# EAGLE design EEZ DIB BP3C r3B1 (EAGLE 7.2.0)
Assembly variants: Farnell, TME

## Sheet 1 of 2
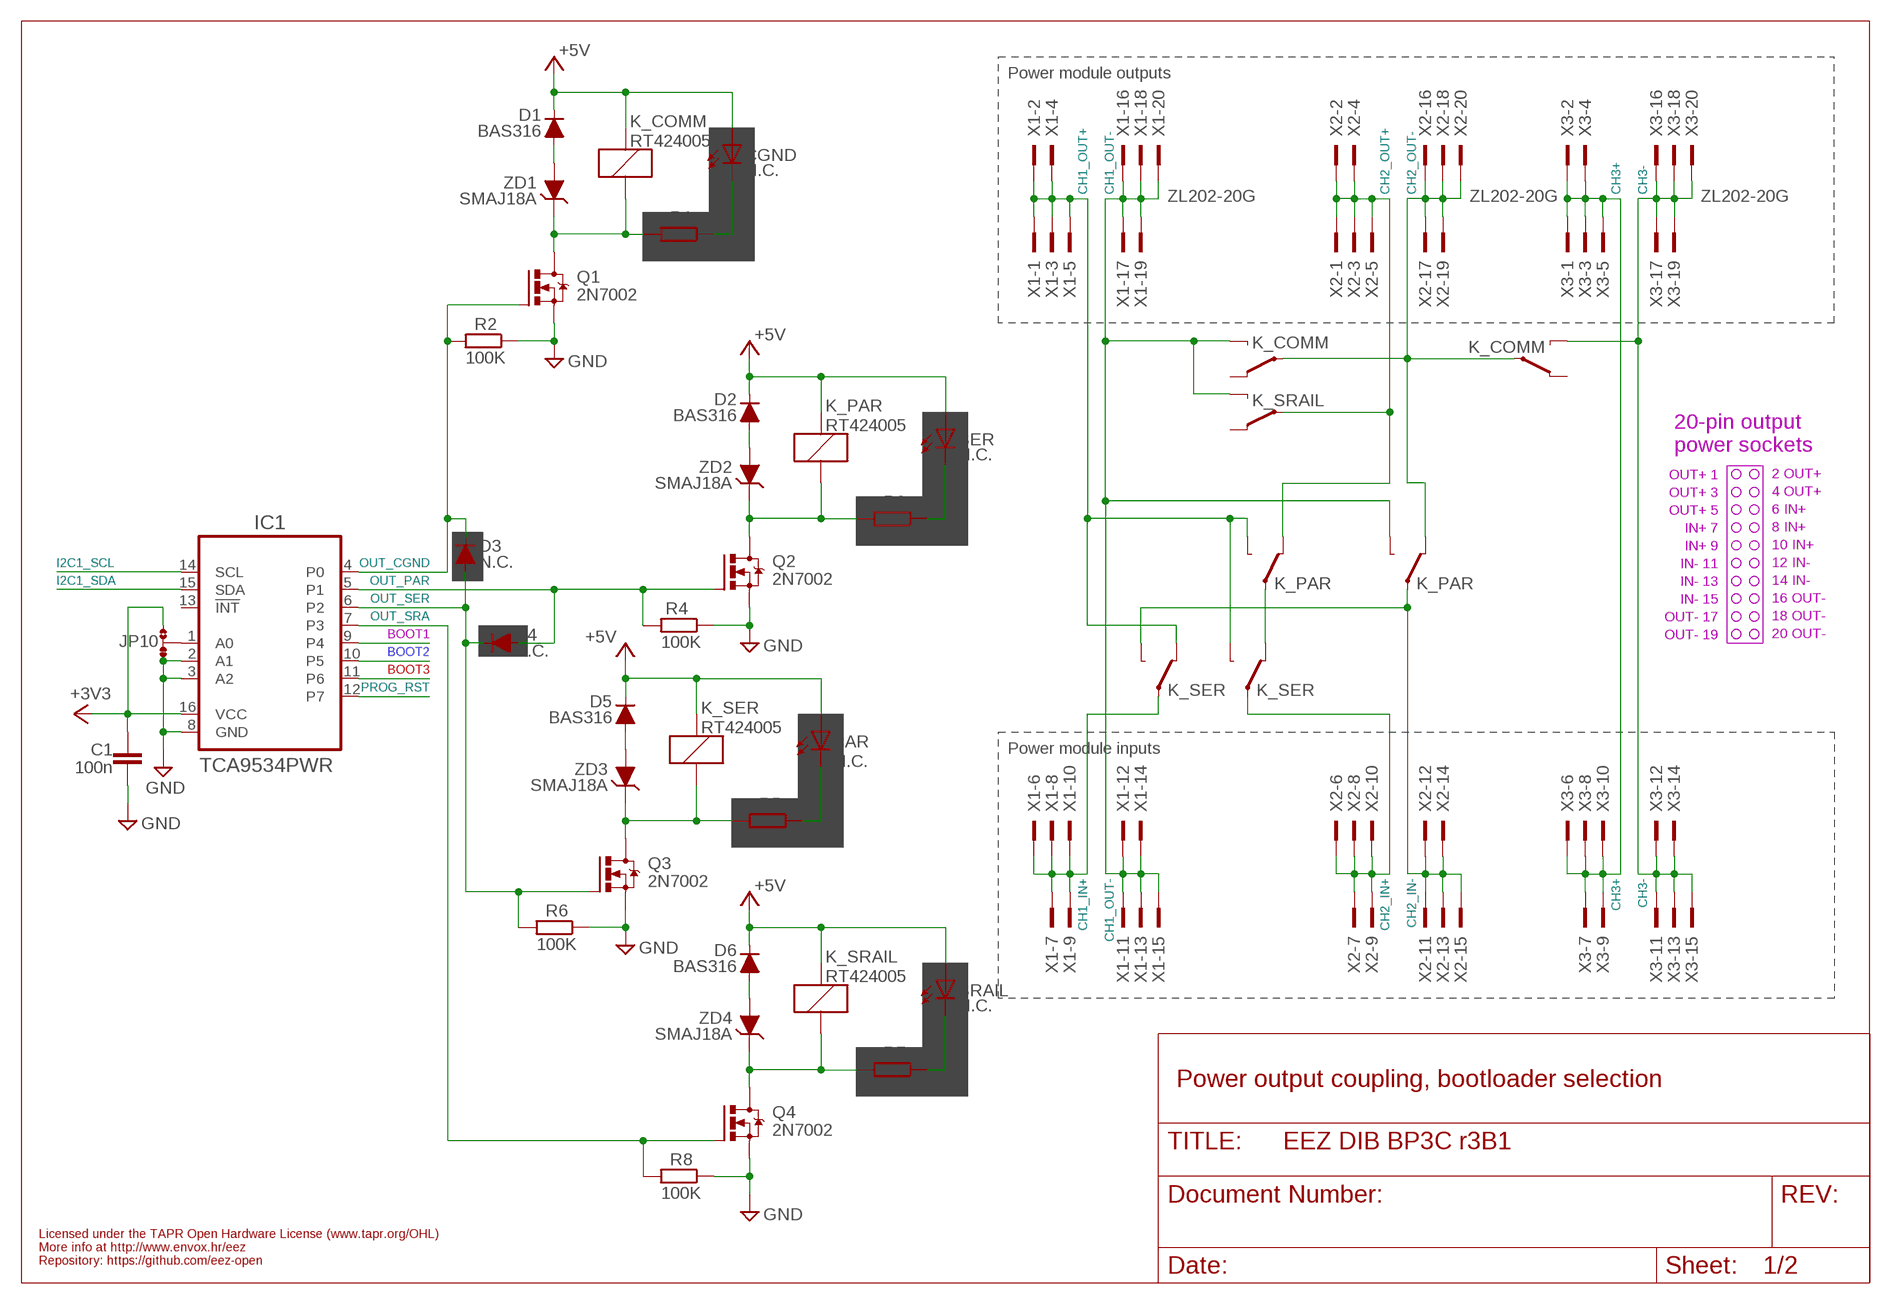
[diagram p0: schematic, sheet 1]

### Parts
C1  100n  C-EUC0603  [C0603]
CGND  N.C.  LED0805  [LED_0805]
D1  BAS316  DIODESOD323R  [SOD323-R]
D2  BAS316  DIODESOD323R  [SOD323-R]
D3  N.C.  DIODESOD323R  [SOD323-R]
D4  N.C.  DIODESOD323R  [SOD323-R]
D5  BAS316  DIODESOD323R  [SOD323-R]
D6  BAS316  DIODESOD323R  [SOD323-R]
IC1  TCA9534PWR  [PW(R-PDSO-G16)]
JP10  JP3-CUT  [JP3-CUT]
K_COMM  RT424005  RELAY_RT314012-2  [RT-C/016A5_ROUND]
K_PAR  RT424005  RELAY_RT314012-2  [RT-C/016A5_ROUND]
K_SER  RT424005  RELAY_RT314012-2  [RT-C/016A5_ROUND]
K_SRAIL  RT424005  RELAY_RT314012-2  [RT-C/016A5_ROUND]
PAR  N.C.  LED0805  [LED_0805]
Q1  2N7002  [SOT103P240X110-3N]
Q2  2N7002  [SOT103P240X110-3N]
Q3  2N7002  [SOT103P240X110-3N]
Q4  2N7002  [SOT103P240X110-3N]
R1  N.C.  R-EU_R0805  [R0805]
R2  100K  R-EU_R0805  [R0805]
R3  N.C.  R-EU_R0805  [R0805]
R4  100K  R-EU_R0805  [R0805]
R5  N.C.  R-EU_R0805  [R0805]
R6  100K  R-EU_R0805  [R0805]
R7  N.C.  R-EU_R0805  [R0805]
R8  100K  R-EU_R0805  [R0805]
SER  N.C.  LED0805  [LED_0805]
SRAIL  N.C.  LED0805  [LED_0805]
X1  ZL202-20G  DS1021-210SF11  [DS1021-2*10SF11]
X2  ZL202-20G  DS1021-210SF11  [DS1021-2*10SF11]
X3  ZL202-20G  DS1021-210SF11  [DS1021-2*10SF11]
ZD1  SMAJ18A  PSMAXX  [DO214AC]
ZD2  SMAJ18A  PSMAXX  [DO214AC]
ZD3  SMAJ18A  PSMAXX  [DO214AC]
ZD4  SMAJ18A  PSMAXX  [DO214AC]

### Nets
+3V3: C1.1 IC1.16(VCC) JP10.NO ; also sheet 2
+5V: CGND.A D1.C D2.C D5.C D6.C K_COMM.A2(K:C1) K_PAR.A2(K:C1) K_SER.A2(K:C1) K_SRAIL.A2(K:C1) PAR.A SER.A SRAIL.A ; also sheet 2
BOOT1: IC1.9(P4) ; also sheet 2
BOOT2: IC1.10(P5) ; also sheet 2
BOOT3: IC1.11(P6) ; also sheet 2
CH1_IN+: K_SER.11A(-1:P) X1.6 X1.7 X1.8 X1.9 X1.10
CH1_OUT+: K_PAR.14A(-1:O) K_SER.12A(-1:S) K_SER.14B(-2:O) X1.1 X1.2 X1.3 X1.4 X1.5
CH1_OUT-: K_COMM.14A(-1:O) K_PAR.14B(-2:O) K_SRAIL.14A(-1:O) X1.11 X1.12 X1.13 X1.14 X1.15 X1.16 X1.17 X1.18 X1.19 X1.20
CH2_IN+: K_SER.11B(-2:P) X2.6 X2.7 X2.8 X2.9 X2.10
CH2_IN-: K_PAR.11B(-2:P) K_SER.14A(-1:O) X2.11 X2.12 X2.13 X2.14 X2.15
CH2_OUT+: K_PAR.12A(-1:S) K_SRAIL.11A(-1:P) X2.1 X2.2 X2.3 X2.4 X2.5
CH2_OUT-: K_COMM.11A(-1:P) K_COMM.11B(-2:P) K_PAR.12B(-2:S) X2.16 X2.17 X2.18 X2.19 X2.20
CH3+: X3.1 X3.2 X3.3 X3.4 X3.5 X3.6 X3.7 X3.8 X3.9 X3.10
CH3-: K_COMM.14B(-2:O) X3.11 X3.12 X3.13 X3.14 X3.15 X3.16 X3.17 X3.18 X3.19 X3.20
GND: C1.2 IC1.2(A1) IC1.3(A2) IC1.8(GND) JP10.NC Q1.2(S) Q2.2(S) Q3.2(S) Q4.2(S) R2.1 R4.1 R6.1 R8.1 ; also sheet 2
I2C1_SCL: IC1.14(SCL) ; also sheet 2
I2C1_SDA: IC1.15(SDA) ; also sheet 2
N$7: PAR.C R5.1
N$8: R3.1 SER.C
N$15: IC1.1(A0) JP10.COM
N$17: K_COMM.A1(K:C2) Q1.3(D) R1.2 ZD1.C
N$18: D1.A ZD1.A
N$19: CGND.C R1.1
N$20: K_SRAIL.A1(K:C2) Q4.3(D) R7.2 ZD4.C
N$21: D6.A ZD4.A
N$22: R7.1 SRAIL.C
N$101: K_SER.A1(K:C2) Q3.3(D) R5.2 ZD3.C
N$102: K_PAR.A1(K:C2) Q2.3(D) R3.2 ZD2.C
N$104: D5.A ZD3.A
N$128: D2.A ZD2.A
OUT_CGND: D3.C IC1.4(P0) Q1.1(G) R2.2
OUT_PAR: D4.A IC1.5(P1) Q2.1(G) R4.2
OUT_SER: D3.A D4.C IC1.6(P2) Q3.1(G) R6.2
OUT_SRA: IC1.7(P3) Q4.1(G) R8.2
PROG_RST: IC1.12(P7) ; also sheet 2
SER_PAR: K_PAR.11A(-1:P) K_SER.12B(-2:S)
Unconnected: IC1.13(!INT) K_COMM.12A(-1:S) K_COMM.12B(-2:S) K_SRAIL.11B(-2:P) K_SRAIL.12A(-1:S) K_SRAIL.12B(-2:S) K_SRAIL.14B(-2:O)

### Notes on the sheet
- Power module outputs
- 20-pin output
  power sockets
- OUT+ 1
- 2 OUT+
- OUT+ 3
- 4 OUT+
- OUT+ 5
- 6 IN+
- IN+ 7
- 8 IN+
- IN+ 9
- 10 IN+
- IN- 11
- 12 IN-
- IN- 13
- 14 IN-
- IN- 15
- 16 OUT-
- OUT- 17
- 18 OUT-
- OUT- 19
- 20 OUT-
- Power module inputs
- Power output coupling, bootloader selection
- Licensed under the TAPR Open Hardware License (www.tapr.org/OHL)
- More info at http://www.envox.hr/eez
- Repository: https://github.com/eez-open

## Sheet 2 of 2
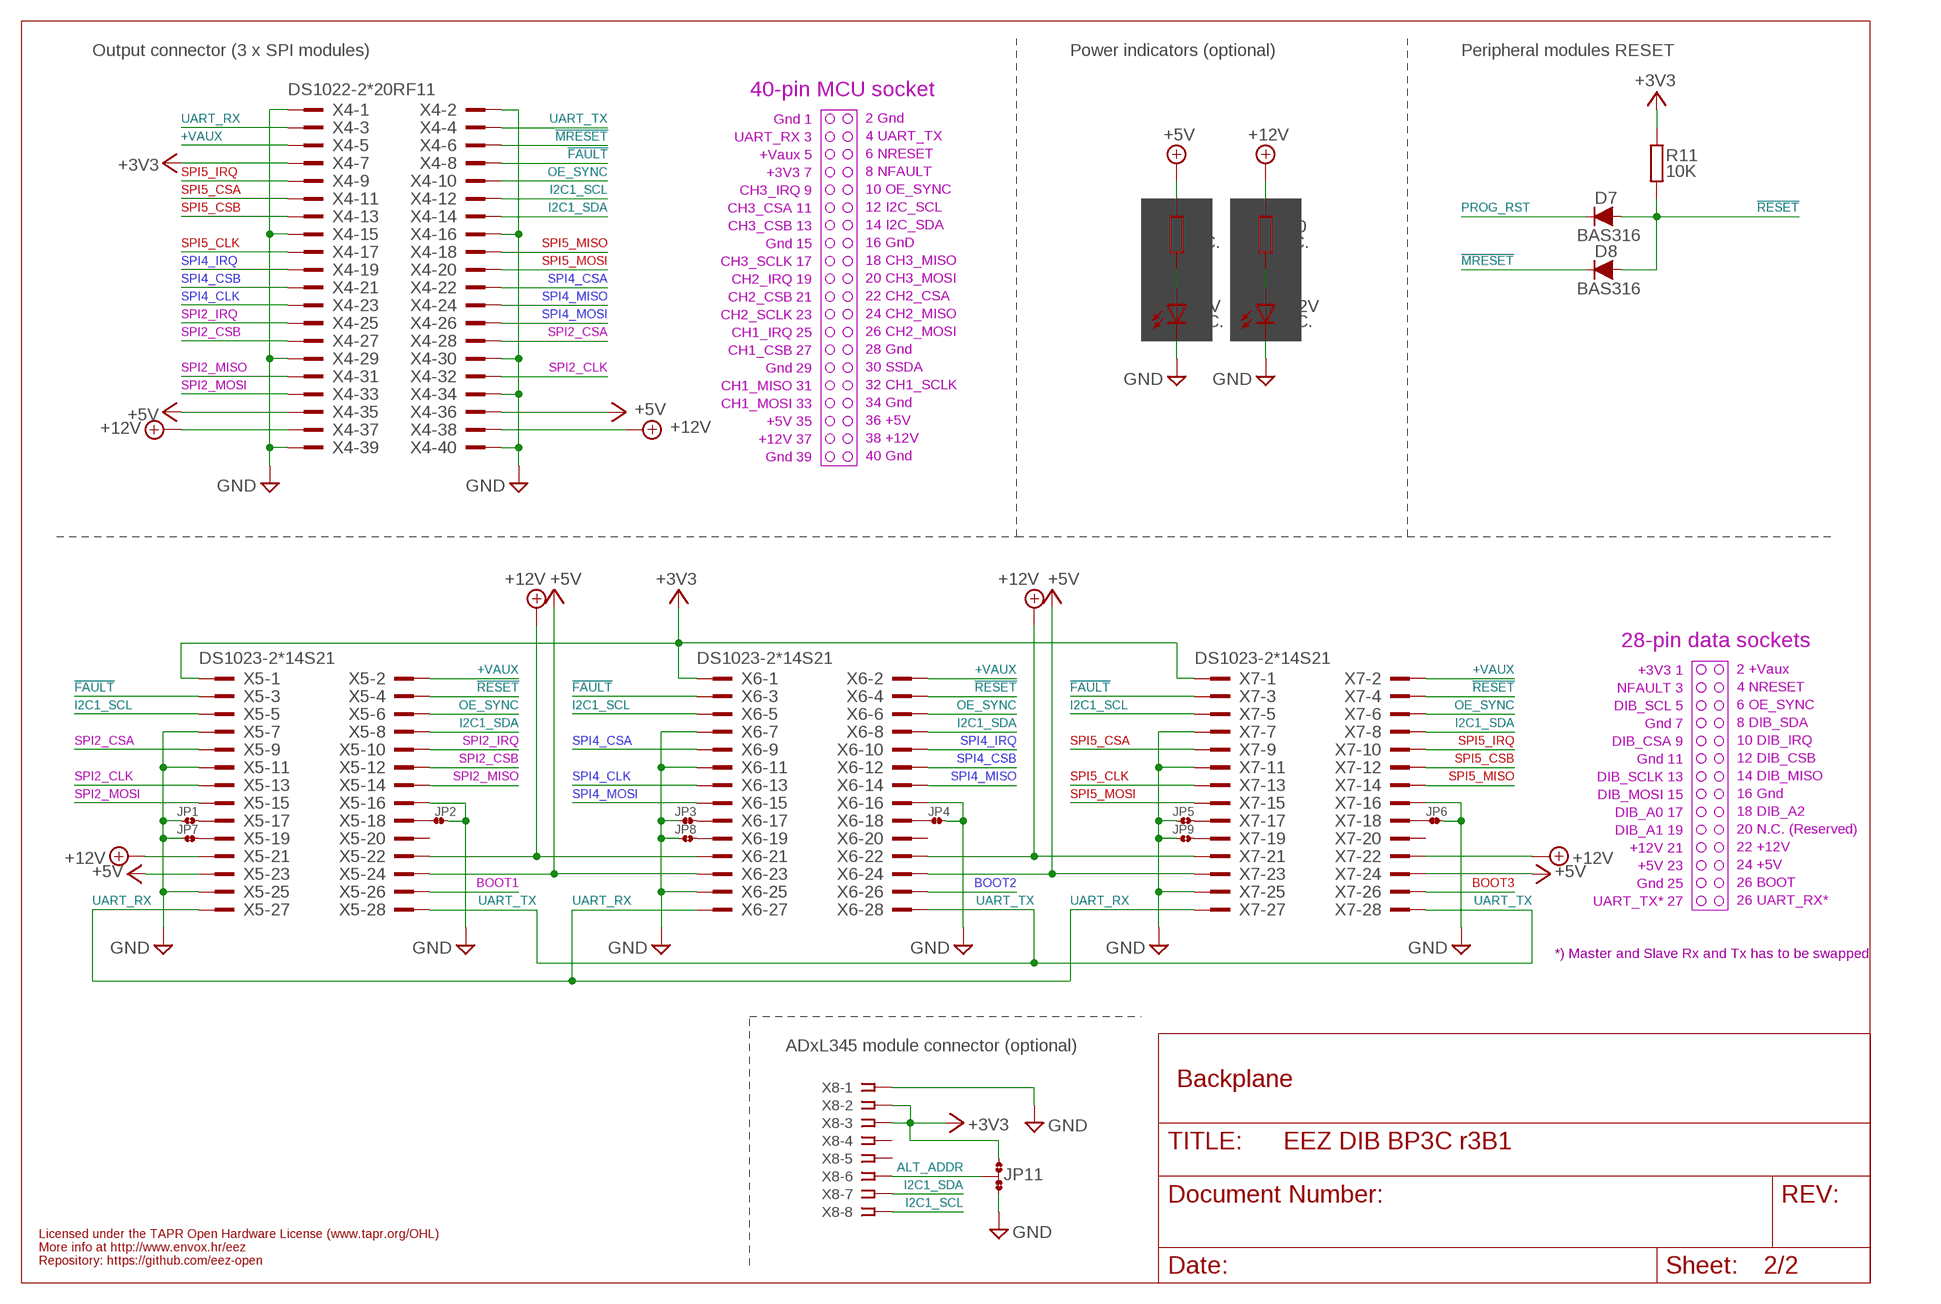
[diagram p1: schematic, sheet 2]

### Parts
+5V  N.C.  LED0805  [LED_0805]
+12V  N.C.  LED0805  [LED_0805]
D7  BAS316  DIODESOD323R  [SOD323-R]
D8  BAS316  DIODESOD323R  [SOD323-R]
JP1  JP2-CUT  [JP2-CUT]
JP2  JP2-NOCUT  [JP2-NOCUT]
JP3  JP2-NOCUT  [JP2-NOCUT]
JP4  JP2-NOCUT  [JP2-NOCUT]
JP5  JP2-CUT  [JP2-CUT]
JP6  JP2-NOCUT  [JP2-NOCUT]
JP7  JP2-NOCUT  [JP2-NOCUT]
JP8  JP2-CUT  [JP2-CUT]
JP9  JP2-CUT  [JP2-CUT]
JP11  JP3-CUT  [JP3-CUT]
R9  N.C.  R-EU_R0805  [R0805]
R10  N.C.  R-EU_R0805  [R0805]
R11  10K  R-EU_R0805  [R0805]
X4  DS1022-2*20RF11  ZL212-40KG  [ZL212-40KG]
X5  DS1023-2*14S21  TSW-114-07-F-D  [TSW-114-07-F-D]
X6  DS1023-2*14S21  TSW-114-07-F-D  [TSW-114-07-F-D]
X7  DS1023-2*14S21  TSW-114-07-F-D  [TSW-114-07-F-D]
X8  N.C.  SSW-108-02-S-S  [SSW-108-02-S-S]

### Nets
!FAULT: X4.8 X5.3 X6.3 X7.3
!MRESET: D8.C X4.6
!RESET: D7.A D8.A R11.2 X5.4 X6.4 X7.4
+3V3: JP11.NO R11.1 X4.7 X5.1 X6.1 X7.1 X8.2 X8.3 ; also sheet 1
+5V: R9.1 X4.35 X4.36 X5.23 X5.24 X6.23 X6.24 X7.23 X7.24 ; also sheet 1
+12V: R10.1 X4.37 X4.38 X5.21 X5.22 X6.21 X6.22 X7.21 X7.22
+VAUX: X4.5 X5.2 X6.2 X7.2
ALT_ADDR: JP11.COM X8.6
BOOT1: X5.26 ; also sheet 1
BOOT2: X6.26 ; also sheet 1
BOOT3: X7.26 ; also sheet 1
GND: +5V.C +12V.C JP1.1 JP2.2 JP3.1 JP4.2 JP5.1 JP6.2 JP7.1 JP8.1 JP9.1 JP11.NC X4.1 X4.2 X4.15 X4.16 X4.29 X4.30 X4.34 X4.39 X4.40 X5.7 X5.11 X5.16 X5.25 X6.7 X6.11 X6.16 X6.25 X7.7 X7.11 X7.16 X7.25 X8.1 ; also sheet 1
I2C1_SCL: X4.12 X5.5 X6.5 X7.5 X8.8 ; also sheet 1
I2C1_SDA: X4.14 X5.8 X6.8 X7.8 X8.7 ; also sheet 1
N$2: JP2.1 X5.18
N$3: +5V.A R9.2
N$4: +12V.A R10.2
N$5: JP1.2 X5.17
N$6: JP7.2 X5.19
N$9: JP4.1 X6.18
N$10: JP3.2 X6.17
N$11: JP8.2 X6.19
N$12: JP6.1 X7.18
N$13: JP5.2 X7.17
N$14: JP9.2 X7.19
OE_SYNC: X4.10 X5.6 X6.6 X7.6
PROG_RST: D7.C ; also sheet 1
SPI2_CLK: X4.32 X5.13
SPI2_CSA: X4.28 X5.9
SPI2_CSB: X4.27 X5.12
SPI2_IRQ: X4.25 X5.10
SPI2_MISO: X4.31 X5.14
SPI2_MOSI: X4.33 X5.15
SPI4_CLK: X4.23 X6.13
SPI4_CSA: X4.22 X6.9
SPI4_CSB: X4.21 X6.12
SPI4_IRQ: X4.19 X6.10
SPI4_MISO: X4.24 X6.14
SPI4_MOSI: X4.26 X6.15
SPI5_CLK: X4.17 X7.13
SPI5_CSA: X4.11 X7.9
SPI5_CSB: X4.13 X7.12
SPI5_IRQ: X4.9 X7.10
SPI5_MISO: X4.18 X7.14
SPI5_MOSI: X4.20 X7.15
UART_RX: X4.3 X5.27 X6.27 X7.27
UART_TX: X4.4 X5.28 X6.28 X7.28
Unconnected: X5.20 X6.20 X7.20 X8.4 X8.5

### Notes on the sheet
- Output connector (3 x SPI modules) | Power indicators (optional) | Peripheral modules RESET
- 40-pin MCU socket
- Gnd 1
- 2 Gnd
- UART_RX 3
- 4 UART_TX
- +Vaux 5
- 6 NRESET
- +3V3 7
- 8 NFAULT
- CH3_IRQ 9
- 10 OE_SYNC
- CH3_CSA 11
- 12 I2C_SCL
- CH3_CSB 13
- 14 I2C_SDA
- Gnd 15
- 16 GnD
- CH3_SCLK 17
- 18 CH3_MISO
- CH2_IRQ 19
- 20 CH3_MOSI
- CH2_CSB 21
- 22 CH2_CSA
- CH2_SCLK 23
- 24 CH2_MISO
- CH1_IRQ 25
- 26 CH2_MOSI
- CH1_CSB 27
- 28 Gnd
- Gnd 29
- 30 SSDA
- CH1_MISO 31
- 32 CH1_SCLK
- CH1_MOSI 33
- 34 Gnd
- +5V 35
- 36 +5V
- +12V 37
- 38 +12V
- Gnd 39
- 40 Gnd
- 28-pin data sockets
- +3V3 1
- 2 +Vaux
- NFAULT 3
- 4 NRESET
- DIB_SCL 5
- 6 OE_SYNC
- Gnd 7
- 8 DIB_SDA
- DIB_CSA 9
- 10 DIB_IRQ
- Gnd 11
- 12 DIB_CSB
- DIB_SCLK 13
- 14 DIB_MISO
- DIB_MOSI 15
- 16 Gnd
- DIB_A0 17
- 18 DIB_A2
- DIB_A1 19
- 20 N.C. (Reserved)
- +12V 21
- 22 +12V
- +5V 23
- 24 +5V
- Gnd 25
- 26 BOOT
- UART_TX* 27
- 26 UART_RX*
- *) Master and Slave Rx and Tx has to be swapped
- ADxL345 module connector (optional)
- Backplane
- Licensed under the TAPR Open Hardware License (www.tapr.org/OHL)
- More info at http://www.envox.hr/eez
- Repository: https://github.com/eez-open

## Library data of the parts
+5V +12V CGND PAR SER SRAIL = EEZ_Lib1:LED
C1 = rcl:C-EU: CAPACITOR, European symbol
D1-D8 = EEZ_Lib1:DIODE
IC1 = EEZ_DIB:TCA9534: Low Voltage 8-Bit I2C and SMBUS Low-Power I/O Expander with Interrupt Output and Configuration Registers
JP1 JP5 JP8 JP9 = EEZ_Lib1:JP2-CUT
JP2-JP4 JP6 JP7 = EEZ_Lib1:JP2-NOCUT
JP10 JP11 = EEZ_Lib1:JP3-CUT
K_COMM K_PAR K_SER K_SRAIL = EEZ_Lib1:RELAY_RT314012
Q1-Q4 = EEZ_Lib1:2N7002: N-CHANNEL ENHANCEMENT MODE FIELD EFFECT TRANSISTOR; MPN: 2N7002-7-F; OC_FARNELL: 1713823; OC_NEWARK: 25R5679; PACKAGE: SOT-23-3; SUPPLIER: DIODES INC.
R1-R11 = rcl:R-EU_: RESISTOR, European symbol
X1-X3 = EEZ_connectors:DS1021-2*10SF11: Pin header; pin strips; male; PIN:20; straight; 2.54mm; THT; 2x10; FARNELL: 2025179
X4 = EEZ_connectors:ZL212-40KG
X5-X7 = EEZ_connectors:TSW-114-07-F-D: Samtec TSW Header, 2.54MM, THT, 28-way
X8 = con-samtec:SSW-108-02-S-S: THROUGH-HOLE .025" SQ POST SOCKET Source: Samtec SSW.pdf; MPN: SSW-108-02-S-S; OC_FARNELL: unknown; OC_NEWARK: 11P9448
ZD1-ZD4 = EEZ_Lib1:PSMAXX: Transient Voltage Suppressor, TVS, P4SMA Series, Unidirectional

## Net classes
0 default: width 0.152 mm, drill 0.3 mm, clearance 0.152 mm
1 diff: width 0.152 mm, drill 0.3 mm, clearance 0.152 mm
2 gnd: width 0.152 mm, drill 0.3 mm, clearance 0.152 mm

## Board
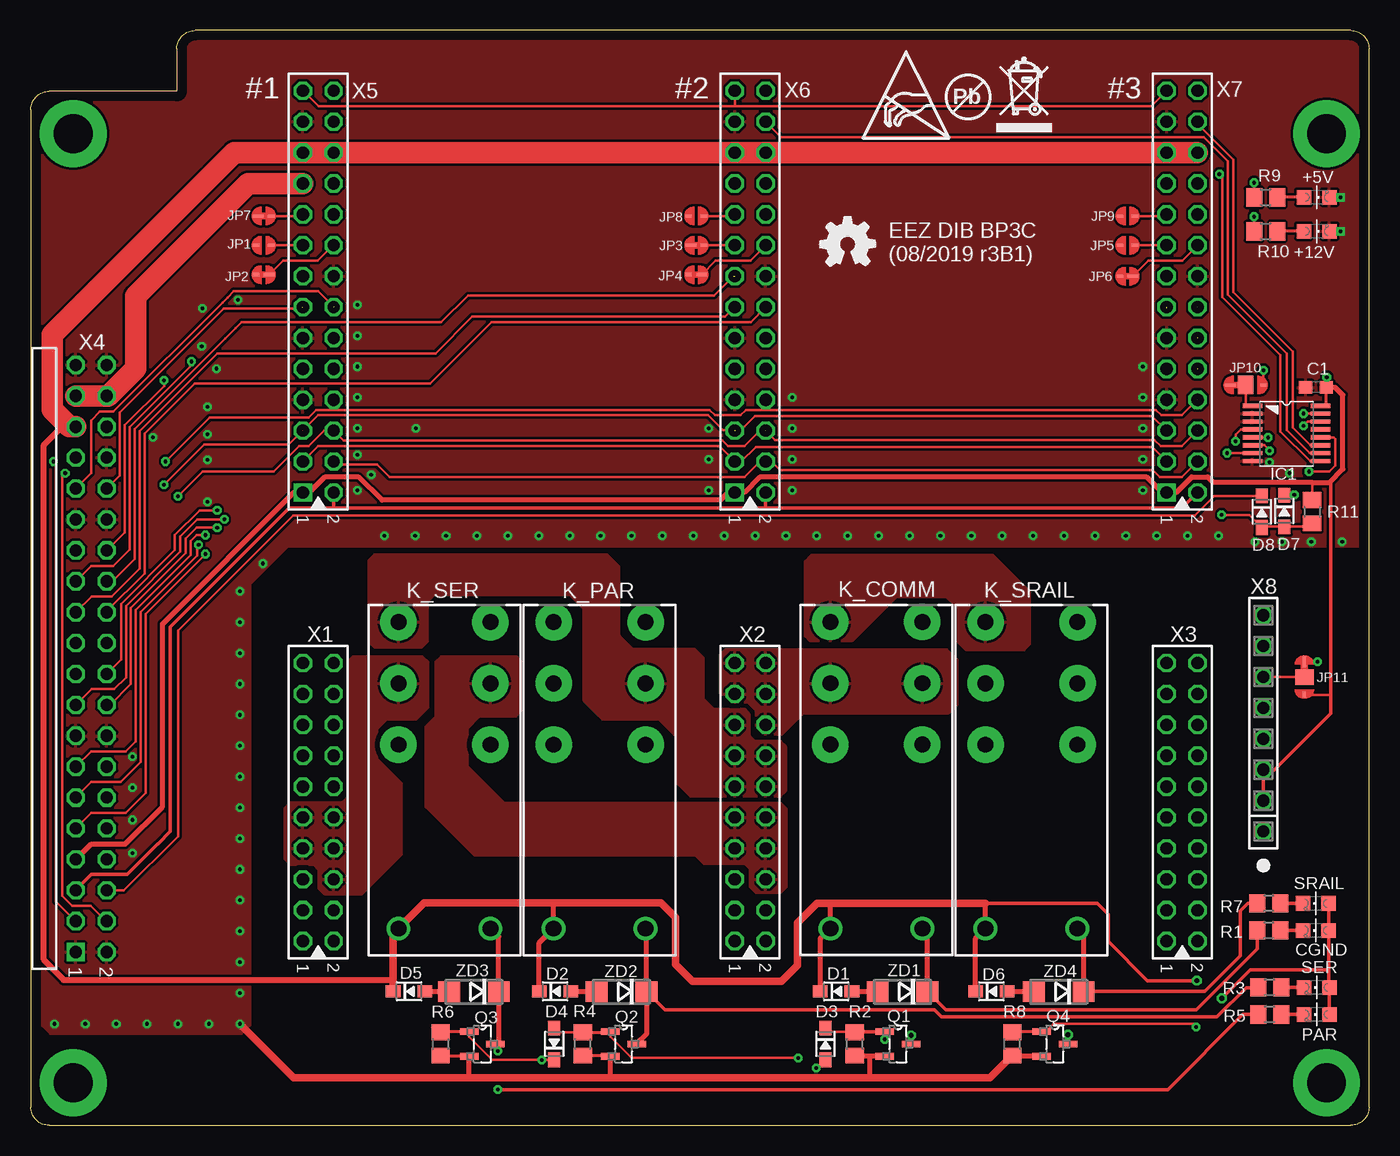
[diagram p2: board, top side]
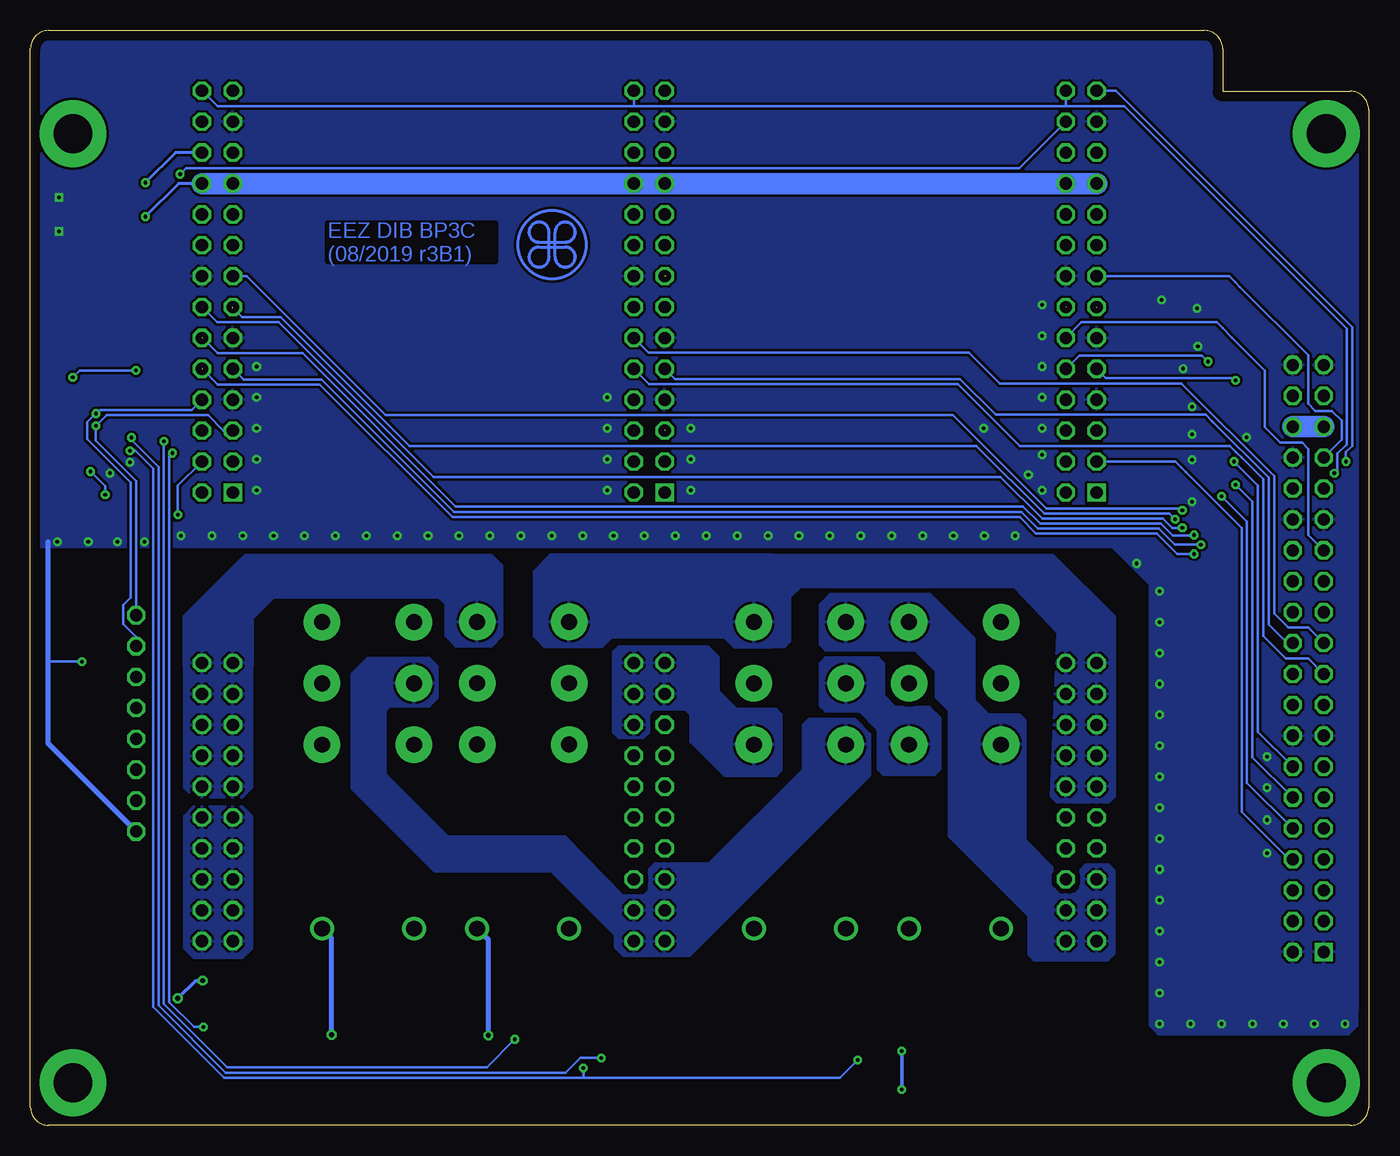
[diagram p3: board, bottom side, seen from below]

Size 110 x 90 mm. Coordinates in mm from the lower left corner, seen from the top.
Outline: 1.5,0 108.5,0 arc90 110,1.5 110,88.5 arc90 108.5,90 13.5,90 arc90 12,88.5 12,85 1.5,85 arc90 0,83.5 0,1.5 arc90 1.5,0
Copper layers (1*16): Top 0.035mm / dielectric 1.5mm / Bottom 0.035mm
Design rules "default *": minimum track width 6mil, minimum drill 0.3mm, track to track 4mil, track to pad 4mil, pad to pad 4mil, via to via 4mil, smd to smd 4mil, copper to edge 30mil, drill to drill 8mil, minimum pad ring 4mil, minimum via ring 8mil, stop-mask expansion 2.5mil, vias tented up to drill 0.6mm, thermal gap 8mil

### Footprints (pad centres in the part's own frame; a part is rotated, then mirrored left to right if it is on the bottom)
LED_0805 = smd 1.2 x 1.2: A 0,-1.05; C 0,1.05
C0603 = smd 1.1 x 1: 1 -0.85,0; 2 0.85,0
SOD323-R = smd 1.2 x 1: A 1.3,0; C -1.3,0
PW(R-PDSO-G16) = smd 1.6 x 0.35: 1 -2.8,2.3; 2 -2.8,1.65; 3 -2.8,1; 4 -2.8,0.35; 5 -2.8,-0.3; 6 -2.8,-0.95; 7 -2.8,-1.6; 8 -2.8,-2.25; 9 2.8,-2.25; 10 2.8,-1.6; 11 2.8,-0.95; 12 2.8,-0.3; 13 2.8,0.35; 14 2.8,1; 15 2.8,1.65; 16 2.8,2.3
JP2-CUT = smd 0.508 x 0.254: 1 -0.635,0; 2 0.635,0
JP2-NOCUT = smd 0.889 x 0.254: 1 -0.445,0 | smd 0.508 x 0.254: 2 0.635,0
JP3-CUT = smd 1.27 x 1.524: COM 0,0 | smd 0.889 x 0.254: NC -1.27,0 | smd 0.508 x 0.254: NO 1.46,0
RT-C/016A5_ROUND = drill 1.3 pad 3: 11A 8.83,3.78; 11B 8.83,-3.78; 12A 3.79,3.78; 12B 3.79,-3.78; 14A 13.87,3.78; 14B 13.87,-3.78 | drill 1.3: A1 -11.33,-3.78; A2 -11.33,3.78
SOT103P240X110-3N = smd 1.524 x 0.559: 1 -1.079,1.016; 2 -1.079,-1.016; 3 1.079,0
R0805 = smd 1.3 x 1.5: 1 -0.95,0; 2 0.95,0
DS1021-2*10SF11 = drill 1 pad 1.5 octagon: 1 22.86,0; 2 22.86,2.54; 3 20.32,0; 4 20.32,2.54; 5 17.78,0; 6 17.78,2.54; 7 15.24,0; 8 15.24,2.54; 9 12.7,0; 10 12.7,2.54; 11 10.16,0; 12 10.16,2.54; 13 7.62,0; 14 7.62,2.54; 15 5.08,0; 16 5.08,2.54; 17 2.54,0; 18 2.54,2.54; 19 0,0; 20 0,2.54
ZL212-40KG = drill 1 pad 1.5 square: 1 48.26,0 | drill 1 pad 1.5 octagon: 2 48.26,2.54; 3 45.72,0; 4 45.72,2.54; 5 43.18,0; 6 43.18,2.54; 7 40.64,0; 8 40.64,2.54; 9 38.1,0; 10 38.1,2.54; 11 35.56,0; 12 35.56,2.54; 13 33.02,0; 14 33.02,2.54; 15 30.48,0; 16 30.48,2.54; 17 27.94,0; 18 27.94,2.54; 19 25.4,0; 20 25.4,2.54; 21 22.86,0; 22 22.86,2.54; 23 20.32,0; 24 20.32,2.54; 25 17.78,0; 26 17.78,2.54; 27 15.24,0; 28 15.24,2.54; 29 12.7,0; 30 12.7,2.54; 31 10.16,0; 32 10.16,2.54; 33 7.62,0; 34 7.62,2.54; 35 5.08,0; 36 5.08,2.54; 37 2.54,0; 38 2.54,2.54; 39 0,0; 40 0,2.54
TSW-114-07-F-D = drill 1 pad 1.5 square: 1 33.02,0 | drill 1 pad 1.5 octagon: 2 33.02,2.54; 3 30.48,0; 4 30.48,2.54; 5 27.94,0; 6 27.94,2.54; 7 25.4,0; 8 25.4,2.54; 9 22.86,0; 10 22.86,2.54; 11 20.32,0; 12 20.32,2.54; 13 17.78,0; 14 17.78,2.54; 15 15.24,0; 16 15.24,2.54; 17 12.7,0; 18 12.7,2.54; 19 10.16,0; 20 10.16,2.54; 21 7.62,0; 22 7.62,2.54; 23 5.08,0; 24 5.08,2.54; 25 2.54,0; 26 2.54,2.54; 27 0,0; 28 0,2.54
SSW-108-02-S-S = drill 1 pad 1.5 octagon: 1 -8.89,0; 2 -6.35,0; 3 -3.81,0; 4 -1.27,0; 5 1.27,0; 6 3.81,0; 7 6.35,0; 8 8.89,0
DO214AC = smd 1.8 x 1.7: A 2.05,0; C -2.05,0

### Placement (x,y rotation side)
+5V  105.69,76.28 270 top
+12V  105.69,73.49 270 top
C1  105.63,60.66 180 top
CGND  105.63,16.02 90 top
D1  66.2,11 0 top
D2  43.08,11 0 top
D3  65.31,6.68 270 top
D4  43.02,6.68 90 top
D5  31.08,11 0 top
D6  78.96,11 0 top
D7  103.03,50.5 270 top
D8  101.19,50.44 270 top
EEZ_SIGNATURE  SIGNATURESMALL  [SIGNATURE_5MM]  67.12,72.39 180 top
IC1  103.22,56.85 0 top
JP1  19.14,72.33 0 top
JP2  19.14,69.92 180 top
JP3  54.7,72.33 0 top
JP4  54.7,69.92 180 top
JP5  90.14,72.33 0 top
JP6  90.14,69.8 180 top
JP7  19.14,74.75 0 top
JP8  54.7,74.75 0 top
JP9  90.14,74.75 0 top
JP10  99.85,60.85 0 top
JP11  104.68,36.85 270 top
K_COMM  69.5,27.5 90 top
K_PAR  46.75,27.5 90 top
K_SER  34,27.5 90 top
K_SRAIL  82.25,27.5 90 top
PAR  105.69,9.11 90 top
Q1  71.28,6.68 0 top
Q2  48.72,6.68 0 top
Q3  37.11,6.68 0 top
Q4  84.17,6.68 0 top
R1  101.76,16.02 180 top
R2  67.72,6.68 90 top
R3  101.83,11.33 180 top
R4  45.37,6.68 90 top
R5  101.83,9.11 180 top
R6  33.69,6.68 90 top
R7  101.76,18.24 180 top
R8  80.68,6.68 90 top
R9  101.5,76.28 0 top
R10  101.5,73.49 0 top
R11  105.31,50.44 270 top
SER  105.69,11.33 90 top
SRAIL  105.63,18.24 90 top
U$2  [RECYCLE_BIN1/8]  79.35,81.61 0 top
U$4  [ESD_SYMBOL]  68.39,81.15 0 top
U$5  [PB_SMALL]  77.05,84.53 180 top
X1  22.36,38 270 top
X2  57.86,38 270 top
X3  93.36,38 270 top
X4  3.7,62.5 270 top
X5  22.36,85.04 270 top
X6  57.86,85.04 270 top
X7  93.36,85.04 270 top
X8  101.31,33.04 90 top
ZD1  71.66,11 180 top
ZD2  48.54,11 180 top
ZD3  36.42,11 180 top
ZD4  84.49,11 180 top

### Tracks (layer width: path | path; a pad name or v marks a point on that pad's centre or on a via)
!FAULT
  Top 0.203: X5.3 23.62,55.83 56.59,55.83 X6.3 58.39,54.56 59.59,55.76 92.17,55.76 X7.3
  Bottom 0.203: X4.8 6.54,21.86 10.45,25.77 10.45,49.1 15.05,53.71 15.4,54.06 15.9,54.56 X5.3
!MRESET
  Top 0.203: D8.C 97.29,51.74 95.66,50.11 21.55,50.11 12.1,40.66 12.1,23.77 7.65,19.32 X4.6
!RESET  (via drill 0.3)
  Top 0.203: X5.4 25.23,54.56 25.49,54.3 28.48,54.3 29.49,53.28 58.64,53.28 59.92,54.56 X6.4 60.86,54.56 61.56,53.86 92.23,53.86 92.8,53.28 94.62,53.28 X7.4 | R11.2 105.03,49.2 D7.A 101.25,49.2 D8.A 100.14,50.18 v97.88,50.18
  Bottom 0.203: X7.4 97.88,52.58 v97.88,50.18
+3V3  (via drill 0.3)
  Top 0.203: JP10.NO v101.31,62.06 | v106.52,61.48 106.52,60.7 C1.1 | R11.1 105.31,52.85 | JP11.NO 106.84,35.39
  Top 0.254: IC1.16 106.48,59.15 C1.1
  Top 0.305: 106.77,52.85 106.84,52.78 106.84,35.39 106.84,33.86 102.2,29.23 X8.3 X8.2
  Top 0.406: X4.7 4.97,23.13 7.78,23.13 10.83,26.18 10.83,41.23 21.62,52.02 X5.1 22.9,52.02 24.16,53.28 26.95,53.28 28.86,51.38 56.67,51.38 57.31,52.02 X6.1 58.65,52.02 59.91,53.28 91.72,53.28 92.99,52.02 X7.1 94.14,52.02 95.42,53.29 96.74,53.29 97.19,52.85 105.31,52.85 106.77,52.85 107.85,53.93 107.85,60.02 107.22,60.66 C1.1 106.14,60.87
  Bottom 0.203: v101.31,62.06 105.95,62.06 v106.52,61.48
  Bottom 0.305: X4.7 3.01,21.86
+5V  (via drill 0.3, 0.4)
  Top 0.203: R9.1 v100.55,77.48 v100.55,77.49
  Top 0.305: PAR.A SER.A 106.68,11.4 106.68,12.78 | 106.68,12.78 CGND.A SRAIL.A | 78.45,18.23 87.66,18.23 88.55,17.34 88.55,15.13 91.79,11.89 v95.85,11.89 | 106.68,12.78 100.23,12.78 v97.88,10.43
  Top 0.406: D2.C 41.78,15 K_PAR.A2 42.96,18.3 | D6.C 77.66,15.36 K_SRAIL.A2 78.47,18.22 78.45,18.23 | 65.69,18.23 65.72,18.2 K_COMM.A2 64.9,15.35 D1.C
  Top 0.508: 29.78,11.95 2.7,11.95 1.07,13.61 1.07,55.92 2.86,57.71
  Top 0.61: 78.45,18.23 65.69,18.23 64.61,18.23 63.02,16.64 63.02,13.16 61.69,11.83 54.39,11.83 52.99,13.22 52.99,17.09 51.78,18.3 42.96,18.3 32.35,18.3 K_SER.A2 29.78,15.69 29.78,11.95 D5.C
  Top 1.778: X4.35 3.14,57.42 2.86,57.71 1.74,58.82 1.74,65 16.7,79.96 X5.23 X5.24 X6.23 X6.24 X7.23 X7.24
  Bottom 0.254: X7.24 98.08,79.96 v100.55,77.49
  Bottom 0.305: v95.85,11.89 96.42,11.89 v97.88,10.43
  Bottom 1.778: X4.36 X4.35
+12V  (via drill 0.3)
  Top 0.203: v100.55,74.69 R10.1
  Top 1.778: X4.37 X4.38 6.38,59.96 8.6,62.18 8.6,68.14 17.88,77.42 X5.21
  Bottom 0.254: v100.55,74.69 97.82,77.42 X7.22
  Bottom 1.778: X5.21 X5.22 X6.21 X6.22 X7.21 X7.22
+VAUX
  Top 0.305: X4.5 3.7,19.34 4.97,20.61 7.91,20.61 10.45,23.14 11.46,24.15 11.46,40.97 21.23,50.74 24.99,50.74 | 24.99,50.74 26.45,50.74 60.4,50.74 | 60.4,50.74 94.62,50.74 X7.2 | X5.2 24.9,50.83 24.99,50.74 | X6.2 60.4,50.74
ALT_ADDR
  Top 0.203: JP11.COM X8.6
BOOT1  (via drill 0.3)
  Top 0.203: IC1.9 105.15,54.6 102.71,57.04 102.71,63.33 97.95,68.09 97.95,77.93 v97.69,78.19
  Bottom 0.203: X5.26 28.71,78.69 97.19,78.69 v97.69,78.19
BOOT2
  Top 0.203: X6.26 61.67,81.22 96.42,81.22 98.39,79.26 98.39,68.28 103.22,63.45 103.22,57.17 105.14,55.25 IC1.10
BOOT3
  Top 0.203: IC1.11 105.18,55.9 103.73,57.36 103.73,63.58 98.84,68.47 98.84,79.39 95.9,82.33 X7.26
CH1_IN+
  pour Top (isolate 0.406): 26.51,38.55 32.16,38.55 32.61,38.11 32.61,34.3 31.65,33.35 29.24,33.35 28.41,32.52 28.41,30.17 30.45,28.14 30.45,22.23 27.21,19 24.16,19 23.72,19.44 23.72,20.96 23.27,21.41 21.37,21.41 20.92,21.85 20.92,26.11 21.37,26.55 25.62,26.55 26.07,27 26.07,38.11
CH1_OUT+
  pour Bottom (isolate 0.406, rank 3): 36.03,43.63 44.29,43.63 45.12,42.81 45.12,39.51 44.67,39.06 37.3,39.06 35.59,37.35 35.59,35.19 34.51,34.11 34.51,23.76 27.97,17.22 27.97,14.04 27.53,13.6 21.43,13.6 20.92,14.11 20.92,20.96 21.37,21.41 23.27,21.41 23.72,20.96 23.72,19.44 24.16,19 25.37,19 26,19.63 26,21.22 28.22,23.44 28.22,33.28 28.67,33.73 31.21,33.73 32.42,34.93 32.42,40.01
CH1_OUT-
  Bottom 0.254: 25.05,38.15 X1.20
  pour Bottom (isolate 0.406): 20.92,27 21.37,26.55 25.62,26.55 26.07,27 25.56,40.46 29.11,44.27 46.7,44.27 47.59,43.38 47.59,39.76 48.04,39.31 52.16,39.31 52.61,39.76 52.55,44.59 50.26,46.87 25.94,46.87 20.92,41.85
  pour Bottom (isolate 0.406): 49.05,46.87 67.28,46.87 68.61,45.54 68.61,40.2 67.78,39.38 62.96,39.38 62.2,40.14 52.99,40.14 52.16,39.31 49.05,39.31
  pour Top (isolate 0.406): 64.17,46.87 79.09,46.87 82.07,43.89 82.07,39.51 81.63,39.06 76.87,39.06 76.1,39.82 76.1,42.62 75.28,43.44 71.15,43.44 67.53,39.82 64.04,39.82 63.66,40.2 63.66,46.36
CH2_IN+
  pour Top (isolate 0.406): 38.89,26.49 61.63,26.49 62.07,26.04 62.07,19.57 61.63,19.12 59.59,19.12 59.15,19.57 59.15,21.03 58.7,21.47 55.34,21.47 54.64,22.17 36.48,22.17 32.48,26.17 32.48,32.77 33.3,33.6 33.3,38.11 33.75,38.55 39.91,38.55 40.35,38.11 40.42,34.17 39.84,33.6 36.86,33.6 35.84,32.58 35.84,29.54
CH2_IN-
  pour Top (isolate 0.406): 27.78,46.43 27.78,39.76 28.22,39.31 32.16,39.31 32.61,39.76 32.61,43.06 33.18,43.63 44.29,43.63 45.43,42.49 45.43,34.93 46.96,33.41 51.59,33.41 52.99,32.01 52.99,28.27 54.2,27.06 61.63,27.06 62.07,27.5 62.07,31.12 61.63,31.57 59.53,31.57 59.09,32.01 59.09,33.73 58.7,34.17 56.16,34.17 55.28,35.06 55.28,38.43 54.58,39.12 49.5,39.12 48.35,40.27 48.35,45.92 47.4,46.87 28.22,46.87
CH2_OUT+
  pour Bottom (isolate 0.406): 40.99,28.77 40.99,32.14 42.19,33.35 46.07,33.35 46.51,32.9 46.51,29.22 54.26,21.47 58.7,21.47 59.15,21.03 59.15,19.31 59.59,18.87 61.94,18.87 61.94,14.61 61.31,13.98 55.78,13.98
  pour Bottom (isolate 0.406): 77.18,38.36 82.33,38.36 83.6,37.09 83.6,27.69 76.8,20.9 67.21,20.9 61.75,15.44 60.8,18.87 61.31,18.87 66.01,23.69 75.66,23.69 80.8,28.84 80.8,34.11 80.42,34.49 77.18,34.49 76.55,35.12 76.55,37.73
CH2_OUT-
  pour Bottom (isolate 0.406, rank 2): 51.97,34.23 48.73,34.23 48.29,33.79 48.29,29.16 48.73,28.71 52.93,28.71 55.72,31.5 55.72,33.73 56.16,34.17 58.77,34.17 59.21,33.73 59.21,32.27 59.66,31.82 61.63,31.82 62.07,32.27 62.07,38.93 61.63,39.38 54.32,39.38 53.5,38.55 53.5,35.76
  pour Top (isolate 0.406): 57.12,39.12 75.28,39.12 76.1,38.3 76.1,34.55 75.41,33.85 63.47,33.85 61.75,32.14 60.1,32.14 59.66,32.58 59.66,34.04 58.96,34.74 57.43,34.74 56.67,35.51 56.67,38.68
CH3+
  pour Bottom (isolate 0.305, rank 2): 91.79,25.41 92.55,26.17 96.61,26.17 97.38,25.41 97.38,14.55 96.61,13.79 92.55,13.79 91.79,14.55
CH3-
  pour Bottom (isolate 0.305): 91.79,38.43 92.55,39.19 96.61,39.19 97.38,38.43 97.38,27.76 96.61,27 92.55,27 91.79,27.76
  pour Bottom (isolate 0.406): 72.1,39.38 75.02,39.38 75.85,40.2 75.85,42.81 76.42,43.38 90.01,43.38 91.79,41.6 91.79,37.79 97.31,37.79 97.38,37.73 97.38,41.85 92.36,46.87 72.1,46.87 71.28,46.05 71.28,40.2
GND  (via drill 0.3)
  Top 0.203: v105.76,38.12 JP11.NC
  Top 0.254: R4.1 47.58,5.73 Q2.2 | Q3.2 33.74,5.67 R6.1
  Top 0.406: 47.66,3.89 47.66,5.65 Q2.2 | Q1.2 68.99,5.67 | 68.99,5.67 67.79,5.67 R2.1 | 68.99,3.89 68.99,5.67 | Q4.2 80.74,5.67 R8.1 | 36.03,3.89 Q3.2
  Top 0.61: R8.1 78.83,3.89 68.99,3.89 47.66,3.89 36.03,3.89 21.62,3.89 v17.18,8.34
  Bottom 0.203: v105.76,38.12 108.55,38.12
  Bottom 0.406: X8.1 108.55,31.39 108.55,38.12 108.55,47.96
  other vias: 91.41,59.83 107.66,73.49 107.66,76.28 55.72,54.75 62.58,54.75 26.83,55.13 91.41,54.75 91.41,57.29 91.41,62.37 10.05,56.54 91.41,52.21 62.58,57.29 62.58,59.83 55.72,57.29 26.83,57.29 26.83,59.83 26.83,62.37 26.83,64.91 26.83,67.45 55.72,52.21 62.58,52.21 31.65,57.29 56.99,48.46 59.53,48.46 67.15,48.46 62.07,48.46 69.69,48.46 64.61,48.46 72.23,48.46 74.77,48.46 77.31,48.46 14.11,67.15 14.05,64.04 14.51,56.79 14.51,54.69 14.51,59.07 79.85,48.46 82.39,48.46 84.93,48.46 87.47,48.46 90.01,48.46 92.55,48.46 95.09,48.46 97.63,48.46 102.84,47.96 100.61,47.96 105.25,47.96 107.79,47.96 14.51,51.26 15.25,62.2 17.03,67.85 26.83,52.21 54.45,48.46 51.91,48.46 49.37,48.46 46.83,48.46 44.29,48.46 17.18,43.9 17.18,41.35 17.18,38.81 17.18,36.27 17.18,33.73 17.18,31.2 17.18,28.66 17.18,26.11 17.18,23.57 17.18,21.04 27.97,53.48 41.75,48.46 39.21,48.46 36.67,48.46 34.13,48.46 31.59,48.46 29.05,48.46 17.18,18.5 17.18,15.95 17.18,13.41 8.35,30.31 8.35,27.77 8.35,25.1 8.35,22.37 101.82,54.5 103.47,53.61 17.18,10.88 14.64,8.34 12.1,8.34 9.56,8.34 7.02,8.34 4.48,8.34 1.94,8.34 19.08,46.18
  pour Bottom (isolate 0.203, rank 3): -0.48,90.68 110.58,90.68 110.58,47.58 21.11,47.58 18,44.47 18,8.21 17.3,7.51 1.62,7.51 0.92,8.21
  pour Top (isolate 0.203, rank 3): -0.76,90.68 110.33,90.68 110.33,47.58 21.11,47.58 18,44.47 18,8.21 17.3,7.51 1.62,7.51 0.92,8.21 -0.79,12.78
HOLE_MCU1  (via drill 3.2 pad 5.5)
  other vias: 106.5,81.5
HOLE_MCU2  (via drill 3.2 pad 5.5)
  other vias: 3.5,81.5
HOLE_MCU3  (via drill 3.2 pad 5.5)
  other vias: 3.5,3.5
HOLE_MCU4  (via drill 3.2 pad 5.5)
  other vias: 106.5,3.5
I2C1_SCL  (via drill 0.3)  (2 unrouted)
  Top 0.203: 57.83,57.13 56.89,57.13 55.66,58.37 23.62,58.37 X5.5 | 22.32,57.1 21.18,55.95 14.25,55.95 v10.95,52.66 | X6.5 58.33,57.1 59.53,58.3 92.16,58.3 X7.5 | 106,57.87 IC1.14 104.98,57.85 v104.61,57.48
  Bottom 0.203: X7.5 94.14,57.1 95.41,58.37 103.73,58.37 v104.61,57.48 | 104.42,57.67 v104.61,57.48 | X4.12 9.55,30.26 9.55,51.26 v10.95,52.66 | X8.8 101.31,52.98 104.61,56.28 v104.61,57.48
I2C1_SDA  (via drill 0.3)  (1 unrouted)
  Top 0.203: 60.42,58.81 92.49,58.81 92.93,58.37 94.61,58.37 95.9,59.65 | 60.42,58.81 58.77,58.81 58.32,58.37 56.23,58.37 55.78,58.81 24.86,58.81 | 24.86,58.81 24.9,58.85 X5.8 | 60.42,58.81 60.4,58.83 X6.8 | 24.86,58.81 23.46,58.81 22.83,58.17 14.69,58.17 v11.08,54.56 | v104.61,58.5 IC1.15
  Bottom 0.203: X7.8 96.73,58.81 104.31,58.81 v104.61,58.5 105.31,57.8 105.31,56.4 101.76,52.85 101.76,43.39 102.39,42.75 102.39,41.23 101.31,40.15 X8.7 | X4.14 9.11,32.35 9.11,52.59 v11.08,54.56
N$2
  Top 0.203: X5.18 24.86,72.34 23.59,71.06 20.73,71.06 JP2.1
N$3
  Top 0.254: +5V.A R9.2
N$4
  Top 0.254: +12V.A R10.2
N$5
  Top 0.203: JP1.2 X5.17
N$6
  Top 0.203: JP7.2 22.23,74.75 X5.19
N$7
  Top 0.305: PAR.C R5.1
N$8
  Top 0.305: SER.C R3.1
N$9
  Top 0.203: X6.18 60.4,72.32 59.15,71.06 56.29,71.06 JP4.1
N$10
  Top 0.203: JP3.2 X6.17
N$11
  Top 0.203: JP8.2 57.73,74.75 X6.19
N$12
  Top 0.203: X7.18 95.9,72.32 94.64,71.06 91.85,71.06 JP6.1
N$13
  Top 0.203: JP5.2 X7.17
N$14
  Top 0.203: JP9.2 93.23,74.75 X7.19
N$15
  Top 0.203: JP10.COM 99.85,59.2 99.79,59.14 100.4,59.14 IC1.1
N$17  (via drill 0.4)
  Top 0.305: R1.2 100.81,14.5 95.79,9.48 75.23,9.48 ZD1.C
  Top 0.406: Q1.3 v72.36,7.38 | ZD1.C 73.71,15.75 K_COMM.A1
  Bottom 0.406: v72.36,7.38 72.36,15.25 K_COMM.A1
N$18
  Top 0.406: D1.A ZD1.A
N$19
  Top 0.305: CGND.C R1.1
N$20  (via drill 0.4)
  Top 0.305: R7.2 100.04,18.24 99.41,17.61 99.41,13.92 96.49,11 ZD4.C
  Top 0.406: Q4.3 v85.25,7.45 | ZD4.C 86.53,15.72 K_SRAIL.A1
  Bottom 0.406: v85.25,7.45 85.25,15.39 K_SRAIL.A1
N$21
  Top 0.406: D6.A ZD4.A
N$22
  Top 0.305: R7.1 SRAIL.C
N$101  (via drill 0.3)
  Top 0.305: R5.2 99.61,9.11 93.44,2.94 v38.38,2.94 | v38.38,6.11 38.38,6.49 Q3.3 38.23,6.71 38.47,6.71
  Top 0.406: K_SER.A1 38.47,15.52 ZD3.C 38.47,6.71
  Bottom 0.305: v38.38,2.94 v38.38,6.11
N$102
  Top 0.254: 50.92,11.33 ZD2.C
  Top 0.305: 50.92,11.33 50.92,11.16 50.45,10.68 50.45,10.62 50.83,10.24 | R3.2 99.92,11.32 97.5,8.91 74.83,8.91 74.26,9.48 52.12,9.48 ZD2.C
  Top 0.406: K_PAR.A1 50.59,16.09 ZD2.C 50.59,7.48 Q2.3
N$104
  Top 0.406: D5.A ZD3.A
N$128
  Top 0.406: D2.A ZD2.A
OE_SYNC  (via drill 0.3)  (2 unrouted)
  Top 0.203: 95.9,57.11 94.61,55.83 92.87,55.83 92.36,56.33 61.18,56.33 60.4,57.11 59.93,57.11 58.64,55.83 57.3,55.83 56.85,56.27 25.73,56.27 X5.6 24.1,57.1 22.83,55.83 22.06,55.83 19.97,53.73 14.12,53.73 v12.1,51.71
  Bottom 0.203: X4.10 6.25,24.4 10,28.15 10,49.61 v12.1,51.71
OUT_CGND  (via drill 0.3)
  Top 0.203: 67.72,7.7 65.59,7.7 D3.C | Q1.1 v70.2,7.06 | IC1.4 99.44,57.2 99.03,56.78 v99.03,56.21
  Top 0.305: Q1.1 67.72,7.7 R2.2
  Bottom 0.203: v70.2,7.06 72.48,4.78 93.82,4.78 99.03,9.99 v99.03,56.21
OUT_PAR  (via drill 0.3)
  Top 0.203: R4.2 43.37,7.63 D4.A | Q2.1 47.64,7.27 49.37,5.54 v63.09,5.54 | IC1.5 101.68,56.55 v101.69,56.53
  Top 0.254: R4.2 47.58,7.63 Q2.1
  Bottom 0.203: v63.09,5.54 64.8,5.54 66.01,4.34 93.95,4.34 99.47,9.86 99.47,54.12 101.69,56.34 v101.69,56.53
OUT_SER  (via drill 0.3)
  Top 0.203: Q3.1 36.03,7.26 37.91,5.38 41.97,5.38 v42,5.35 42.04,5.38 D4.C | D3.A 65.22,5.38 v64.55,4.72 | IC1.6 101.37,55.9 v101.82,55.45
  Top 0.254: Q3.1 33.74,7.7 R6.2 33.14,8.18 33.02,8.05
  Bottom 0.203: v42,5.35 43.47,3.89 64.55,3.89 | v64.55,4.72 64.55,3.89 | 64.55,3.89 94.07,3.89 99.92,9.73 99.92,53.99 101.38,55.45 v101.82,55.45
OUT_SRA  (via drill 0.3)
  Top 0.203: Q4.1 83.41,7.7 84.04,8.34 95.53,8.34 v95.79,8.08 | 100.47,55.2 IC1.7 v98.34,55.25 v98.33,55.26
  Top 0.254: Q4.1 80.68,7.7 R8.2
  Bottom 0.203: v95.79,8.08 96.55,8.08 98.58,10.11 98.58,55.01 v98.33,55.26
PROG_RST  (via drill 0.3)
  Top 0.203: D7.C 103.82,51.8 v103.85,51.83 | v105.06,53.74 106.71,53.74 107.22,54.24 107.22,56.4 107.09,56.53 106.03,56.53 IC1.12
  Bottom 0.203: v103.85,51.83 103.85,52.53 v105.06,53.74
SER_PAR
  pour Bottom (isolate 0.406, rank 2): 40.29,38.43 44.67,38.43 45.12,37.98 45.12,34.49 44.67,34.04 41.94,34.04 40.35,32.46 40.35,29.28 39.91,28.84 35.65,28.84 35.21,29.28 35.21,33.47 36.1,34.36 38.89,34.36 39.84,35.31 39.84,37.98
SPI2_CLK  (1 unrouted)
  Top 0.203: X4.32 7.3,53.4 7.3,58.59 15.84,67.13 22.26,67.13 22.36,67.23
SPI2_CSA  (via drill 0.3)
  Top 0.203: X4.28 7.71,48.73 7.71,57.54 10.95,60.78 v10.95,61.24
  Bottom 0.203: X5.9 21.6,61.42 11.13,61.42 v10.95,61.24
SPI2_CSB
  Bottom 0.203: X4.27 4.97,48.53 4.97,55.6 5.47,56.1 7.26,56.1 8.54,57.38 8.54,62.06 11.24,64.75 11.99,65.51 12.49,66.01 23.61,66.01 X5.12
SPI2_IRQ  (via drill 0.3)
  Top 0.203: X4.25 4.96,45.98 6.79,45.98 8.13,47.32 8.13,57.39 13.21,62.47 v13.21,62.78
  Bottom 0.203: X5.10 23.8,63.28 13.71,63.28 v13.21,62.78
SPI2_MISO  (1 unrouted)
  Top 0.203: X4.31 4.97,53.61 4.97,57.95 5.68,58.66 6.79,58.66 15.78,67.64 16.18,68.05 16.68,68.55 23.62,68.55 24.88,67.29
SPI2_MOSI
  Bottom 0.203: X4.33 2.22,56.36 2.22,57.92 3.02,58.72 4.39,58.72 4.98,59.31 4.98,63.32 10.57,68.91 10.96,69.3 11.46,69.8 X5.15
SPI4_CLK
  Top 0.203: X4.23 5,43.48 6.67,43.48 8.94,45.76 8.94,57.06 15.33,63.44 33.27,63.44 36.28,66.45 57.05,66.45 X6.13
SPI4_CSA
  Bottom 0.203: X6.9 57.03,61.35 33.6,61.35 30.65,58.4 13.4,58.4 12.9,57.9 12.76,57.77 8.22,53.23 8.22,41.16 6.7,39.64 X4.22
SPI4_CSB
  Bottom 0.203: X4.21 4.96,40.9 6.63,40.9 7.78,42.05 7.78,53.36 15.4,60.98 30.33,60.98 32.85,63.5 59.18,63.5 X6.12
SPI4_IRQ
  Bottom 0.203: X6.10 59.16,60.94 33.77,60.94 28.68,55.85 11.41,55.85 10.91,55.35 10.45,54.88 8.67,53.1 8.67,40.21 6.83,38.37 4.98,38.37 3.71,37.1 X4.19
SPI4_MISO
  Top 0.203: X4.24 6.24,42.26 9.35,45.37 9.35,56.85 13.48,60.98 32.82,60.98 37.88,66.04 59.18,66.04 X6.14
SPI4_MOSI  (1 unrouted)
  Top 0.203: X4.26 6.69,44.72 8.53,46.56 8.53,57.23 15.97,64.66 16.82,65.51 17.32,66.01 33.74,66.01 35.93,68.21 56.16,68.21 57.76,69.8
SPI5_CLK  (via drill 0.3)  (1 unrouted)
  Top 0.203: X4.17 4.99,35.85 6.86,35.85 7.82,36.81 7.82,42.69 12.29,47.16 12.29,48.4 13.68,49.8 v15.9,49.8
  Bottom 0.203: 93.36,67.19 92.6,66.43 89.44,66.43 78.83,55.83 32.23,55.83 26.68,50.27 16.38,50.27 v15.9,49.8
SPI5_CSA  (via drill 0.3)
  Top 0.203: X4.11 4.97,28.22 7.4,28.22 9.04,29.86 9.04,42.19 13.68,46.82 13.68,47.62 v13.79,47.73
  Bottom 0.203: X7.9 92.49,61.31 86.05,61.31 75.16,50.43 28.54,50.43 27.17,49.06 17.26,49.06 15.93,47.73 v13.79,47.73
SPI5_CSB  (via drill 0.3)  (1 unrouted)
  Top 0.203: X4.13 4.96,30.74 7.81,30.74 8.64,31.57 8.64,42.35 13.14,46.86 13.14,48.02 13.64,48.52 v14.34,48.52
  Bottom 0.203: 95.9,64.73 94.63,63.46 87.62,63.46 75.04,50.87 28.41,50.87 27,49.46 17.09,49.46 16.1,48.47 14.39,48.47 v14.34,48.52
SPI5_IRQ  (via drill 0.3)  (1 unrouted)
  Top 0.203: X4.9 4.96,25.66 7.8,25.66 9.45,27.31 9.45,42.02 14.34,46.91 v14.34,46.96
  Bottom 0.203: 95.9,62.19 94.61,60.91 86.21,60.91 75.29,49.98 28.67,49.98 27.34,48.65 17.42,48.65 15.73,46.96 v14.34,46.96
SPI5_MISO  (via drill 0.3)  (1 unrouted)
  Top 0.203: X4.18 6.52,34.56 8.23,36.27 8.23,42.53 12.73,47.03 12.73,48.21 13.64,49.13 v15.32,49.13
  Bottom 0.203: 95.9,67.27 94.65,66.02 89.62,66.02 76.88,53.28 30.26,53.28 26.84,49.87 16.93,49.87 16.16,49.1 15.34,49.1 v15.32,49.13
SPI5_MOSI  (via drill 0.3)
  Top 0.203: X4.20 7.42,38.28 7.42,42.86 11.84,47.28 11.84,48.53 13.86,50.55 v15.32,50.55
  Bottom 0.203: X7.15 92.22,69.8 80.79,58.37 34.19,58.37 26.51,50.68 15.45,50.68 v15.32,50.55
UART_RX  (via drill 0.3)
  Top 0.203: X4.3 2.06,18.42 2.06,54.37 v1.87,54.56 | X5.27 22.38,85.04 23.65,83.77 57.82,83.77 | 57.82,83.77 92.08,83.77 X7.27 | X6.27 57.86,83.81 57.82,83.77
  Bottom 0.203: v1.87,54.56 1.87,55.33 1.36,55.83 1.36,65.61 20.79,85.04 X5.27
UART_TX  (via drill 0.3)
  Top 0.203: X4.4 6.19,16.78 4.92,18.05 3.4,18.05 2.57,18.88 2.57,53.36 v2.82,53.61
  Bottom 0.203: v2.82,53.61 2.57,53.86 2.57,55.2 1.81,55.96 1.81,65.48 20.1,83.77 24.86,83.77 | X5.28 24.9,83.81 24.86,83.77 | 24.86,83.77 60.35,83.77 | 60.35,83.77 94.62,83.77 X7.28 | X6.28 60.4,83.81 60.35,83.77

### Text on the board
Bottom: EEZ DIB BP3C / (08/2019 r3B1)
tPlace: #1 | #2 | #3 | EEZ DIB BP3C / (08/2019 r3B1)